# Altium schematic sheet COMS0006 TXDevMux.SchDoc: BLUEsat Switching Circuit
size A3; Engineer: D. JEDRYCHOWSKI; Organization: BLUEsat Project; Address1: Room 419; Address2: School of EE&T; Address3: UNSW, NSW 2052; Address4: Australia; DocumentNumber: COMS0006; SheetNumber: 2; SheetTotal: 4; Description: Selects the AFSK and GMSK modems for transmission; Version: 1.0
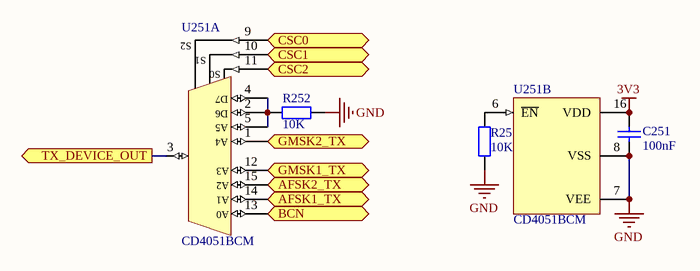
[diagram p0: COMS0006 TXDevMux.SchDoc]

## Parts
C251  value 100nF  [CAP0603]  (hidden comment: Capacitor, ceramic)
R251  value 10K  [RES0603]  (hidden comment: Res1)
R252  value 10K  [RES0603]  (hidden comment: Res1)
U251  CD4051BCM  [TSSOP16]  (parts A,B of 2)

## Ports
AFSK1_TX (in), AFSK2_TX (in), BCN (in), CSC0 (in), CSC1 (in), CSC2 (in), GMSK1_TX (in), GMSK2_TX (in), TX_DEVICE_OUT (out)

## Nets
3V3: C251.2 U251.16(VDD)
GND: C251.1 R251.1 R252.1 U251.7(VEE) U251.8(VSS)
AFSK1_TX: U251.14(A1) ; port AFSK1_TX
AFSK2_TX: U251.15(A2) ; port AFSK2_TX
BCN: U251.13(A0) ; port BCN
CSC0: U251.9(S2) ; port CSC0
CSC1: U251.10(S1) ; port CSC1
CSC2: U251.11(S0) ; port CSC2
GMSK1_TX: U251.12(A3) ; port GMSK1_TX
GMSK2_TX: U251.1(A4) ; port GMSK2_TX
TX_DEVICE_OUT: U251.3(O) ; port TX_DEVICE_OUT
NetR251_2: R251.2 U251.6(~{EN})
NetR252_2: R252.2 U251.2(A6) U251.4(A7) U251.5(A5)

## Notes on the sheet
- Title
- Description:
- Size:
- Author:
- Date:
- A3
- Time:
- Version
- Sheet:
- Drawing No.:
- of
- File:
- (in symbol CD4051BCM, part A) D7; D6

## Library data of the parts
C251 = CAP0603: Capacitor; Supplier 1: Farnell; Supplier Product Range Link: http://au.element14.com/jsp/level5/module.jsp?moduleId=en/208437.xml
R251 R252 = RES0603: Resistor; Supplier: Farnell; Supplier Order Number: *
U251 = CD4051BCM: 8-Channel Analog Multiplexer/Demultiplexer; Datasheet Link: http://focus.ti.com/lit/ds/symlink/cd4052b.pdf; Supplier 1: Farnell; Supplier Part Number 1: 1753421